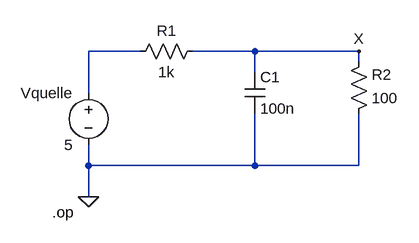
[diagram p0: schematic DCTest.asc]
DCTest.asc, the LTspice schematic file:
Version 4
SHEET 1 880 680
WIRE 208 64 128 64
WIRE 384 64 288 64
WIRE 544 64 384 64
WIRE 544 80 544 64
WIRE 384 96 384 64
WIRE 128 128 128 64
WIRE 128 240 128 208
WIRE 384 240 384 160
WIRE 384 240 128 240
WIRE 544 240 544 160
WIRE 544 240 384 240
WIRE 128 288 128 240
FLAG 128 288 0
FLAG 544 64 X
SYMBOL voltage 128 112 M0
WINDOW 123 0 0 Left 0
WINDOW 39 0 0 Left 0
SYMATTR InstName Vquelle
SYMATTR Value 5
SYMBOL res 304 48 R90
WINDOW 0 0 56 VBottom 2
WINDOW 3 32 56 VTop 2
SYMATTR InstName R1
SYMATTR Value 1k
SYMBOL res 528 176 M180
WINDOW 0 36 76 Left 2
WINDOW 3 36 40 Left 2
SYMATTR InstName R2
SYMATTR Value 100
SYMBOL cap 368 96 R0
SYMATTR InstName C1
SYMATTR Value 100n
TEXT 72 312 Left 2 !.op

The netlist it stands for:
* DCTest.asc
Vquelle N001 0 5
R1 X N001 1k
R2 0 X 100
C1 X 0 100n
.op
.backanno
.end